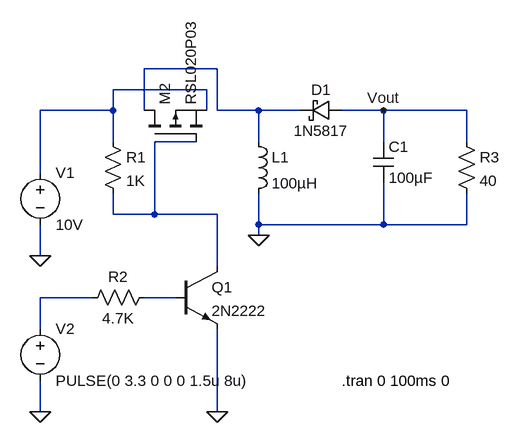
[diagram p0: schematic Buck_Boost_Converter(inverting).asc]
Buck_Boost_Converter(inverting).asc, the LTspice schematic file:
Version 4
SHEET 1 880 680
WIRE 304 -80 192 -80
WIRE 288 -48 144 -48
WIRE 144 -16 144 -48
WIRE 144 -16 32 -16
WIRE 192 -16 192 -80
WIRE 288 -16 288 -48
WIRE 304 -16 304 -80
WIRE 368 -16 304 -16
WIRE 432 -16 368 -16
WIRE 560 -16 496 -16
WIRE 688 -16 560 -16
WIRE 144 32 144 -16
WIRE 272 32 208 32
WIRE 368 32 368 -16
WIRE 560 32 560 -16
WIRE 688 32 688 -16
WIRE 32 80 32 -16
WIRE 144 144 144 112
WIRE 208 144 208 32
WIRE 208 144 144 144
WIRE 304 144 208 144
WIRE 368 160 368 112
WIRE 560 160 560 96
WIRE 560 160 368 160
WIRE 688 160 688 112
WIRE 688 160 560 160
WIRE 368 176 368 160
WIRE 32 208 32 160
WIRE 304 224 304 144
WIRE 112 272 32 272
WIRE 240 272 192 272
WIRE 32 320 32 272
WIRE 32 448 32 400
WIRE 304 448 304 320
FLAG 32 208 0
FLAG 32 448 0
FLAG 304 448 0
FLAG 368 176 0
FLAG 560 -16 Vout
SYMBOL voltage 32 64 R0
WINDOW 123 0 0 Left 0
WINDOW 39 0 0 Left 0
SYMATTR InstName V1
SYMATTR Value 10V
SYMBOL voltage 32 304 R0
WINDOW 123 0 0 Left 0
WINDOW 39 0 0 Left 0
SYMATTR InstName V2
SYMATTR Value PULSE(0 3.3 0 0 0 1.5u 8u)
SYMBOL res 128 16 R0
SYMATTR InstName R1
SYMATTR Value 1K
SYMBOL res 208 256 R90
WINDOW 0 0 56 VBottom 2
WINDOW 3 32 56 VTop 2
SYMATTR InstName R2
SYMATTR Value 4.7K
SYMBOL npn 240 224 R0
SYMATTR InstName Q1
SYMATTR Value 2N2222
SYMBOL pmos 192 32 R270
SYMATTR InstName M2
SYMATTR Value RSL020P03
SYMBOL ind 352 16 R0
SYMATTR InstName L1
SYMATTR Value 100µH
SYMBOL schottky 496 -32 R90
WINDOW 0 0 32 VBottom 2
WINDOW 3 32 32 VTop 2
SYMATTR InstName D1
SYMATTR Value 1N5817
SYMATTR Description Diode
SYMATTR Type diode
SYMBOL cap 544 32 R0
SYMATTR InstName C1
SYMATTR Value 100µF
SYMBOL res 672 16 R0
SYMATTR InstName R3
SYMATTR Value 40
TEXT 496 400 Left 2 !.tran 0 100ms 0

The netlist it stands for:
* Buck_Boost_Converter(inverting).asc
V1 N002 0 10V
V2 N004 0 PULSE(0 3.3 0 0 0 1.5u 8u)
R1 N002 N003 1K
R2 N005 N004 4.7K
Q1 N003 N005 0 0 2N2222
M2 N001 N003 N002 N002 RSL020P03
L1 N001 0 100µH
D1 Vout N001 1N5817
C1 Vout 0 100µF
R3 Vout 0 40
.model D D
.lib standard.dio
.model NPN NPN
.model PNP PNP
.lib standard.bjt
.model NMOS NMOS
.model PMOS PMOS
.lib standard.mos
.tran 0 100ms 0
.backanno
.end